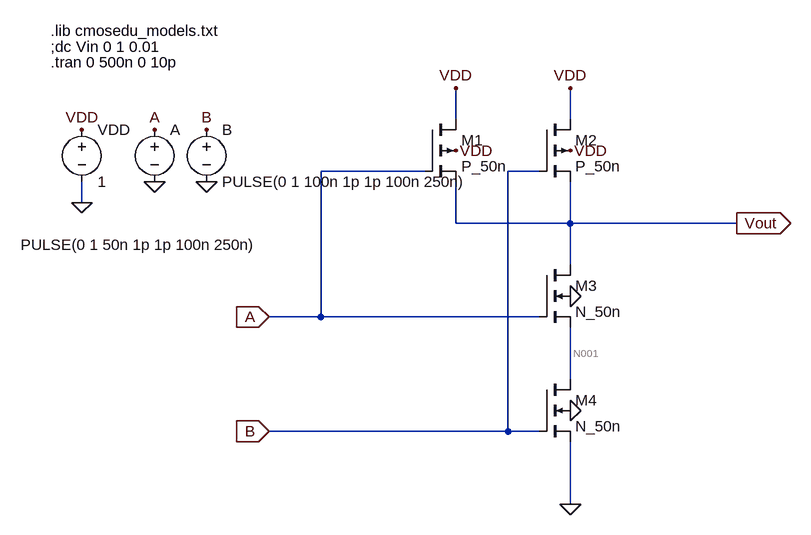
[diagram p0: schematic NAND.asc]
NAND.asc, the LTspice schematic file:
Version 4
SHEET 1 880 680
WIRE -304 -304 -304 -352
WIRE -128 -304 -128 -352
WIRE -352 -224 -512 -224
WIRE -176 -224 -224 -224
WIRE -880 -176 -880 -208
WIRE -304 -144 -304 -208
WIRE -128 -144 -128 -208
WIRE -128 -144 -304 -144
WIRE 128 -144 -128 -144
WIRE -128 -80 -128 -144
WIRE -512 0 -512 -224
WIRE -512 0 -592 0
WIRE -176 0 -512 0
WIRE -128 96 -128 16
WIRE -224 176 -224 -224
WIRE -224 176 -592 176
WIRE -176 176 -224 176
WIRE -128 288 -128 192
FLAG -880 -176 0
FLAG -880 -288 VDD
FLAG -768 -288 A
FLAG -688 -288 B
FLAG -768 -208 0
FLAG -688 -208 0
FLAG -128 288 0
FLAG -304 -352 VDD
FLAG -128 -352 VDD
FLAG -592 0 A
IOPIN -592 0 In
FLAG -592 176 B
IOPIN -592 176 In
FLAG -304 -256 VDD
FLAG -128 -256 VDD
FLAG -128 -32 0
FLAG -128 144 0
FLAG 128 -144 Vout
IOPIN 128 -144 Out
SYMBOL voltage -880 -304 R0
SYMATTR InstName VDD
SYMATTR Value 1
SYMBOL voltage -768 -304 R0
WINDOW 3 -206 193 Left 2
WINDOW 123 0 0 Left 0
WINDOW 39 0 0 Left 0
SYMATTR InstName A
SYMATTR Value PULSE(0 1 50n 1p 1p 100n 250n)
SYMBOL voltage -688 -304 R0
WINDOW 123 0 0 Left 0
WINDOW 39 0 0 Left 0
SYMATTR InstName B
SYMATTR Value PULSE(0 1 100n 1p 1p 100n 250n)
SYMBOL pmos4 -352 -304 R0
SYMATTR InstName M1
SYMATTR Value P_50n
SYMATTR Value2 l=50n w=0.4u
SYMBOL pmos4 -176 -304 R0
SYMATTR InstName M2
SYMATTR Value P_50n
SYMATTR Value2 l=50n w=0.4u
SYMBOL nmos4 -176 -80 R0
SYMATTR InstName M3
SYMATTR Value N_50n
SYMATTR Value2 l=50n w=0.4u
SYMBOL nmos4 -176 96 R0
SYMATTR InstName M4
SYMATTR Value N_50n
SYMATTR Value2 l=50n w=0.4u
TEXT -928 -416 Left 2 !;dc Vin 0 1 0.01
TEXT -928 -440 Left 2 !.lib cmosedu_models.txt
TEXT -928 -392 Left 2 !.tran 0 500n 0 10p

The netlist it stands for:
* NAND.asc
VDD VDD 0 1
V§A A 0 PULSE(0 1 50n 1p 1p 100n 250n)
V§B B 0 PULSE(0 1 100n 1p 1p 100n 250n)
M1 VDD A Vout VDD P_50n l=50n w=0.4u
M2 VDD B Vout VDD P_50n l=50n w=0.4u
M3 Vout A N001 0 N_50n l=50n w=0.4u
M4 N001 B 0 0 N_50n l=50n w=0.4u
.model NMOS NMOS
.model PMOS PMOS
.lib standard.mos
;dc Vin 0 1 0.01
.lib cmosedu_models.txt
.tran 0 500n 0 10p
.backanno
.end

* Results of the author's LTspice run, read from the files saved beside the schematic
* Operating Point, zero values left out:
*   V(vdd) = 1 V
*   V(vout) = 1 V
*   V(n001) = 38.1 mV
*   Id(M4) = 643.9 pA
*   Is(M4) = -643.8 pA
*   Id(M3) = 1.139 nA
*   Ig(M3) = -494.3 pA
*   Ib(M3) = -1.038 pA
*   Is(M3) = -643.9 pA
*   Id(M2) = 7.435 nA
*   Ig(M2) = -6.92 nA
*   Ib(M2) = 54.88 pA
*   Is(M2) = -569.6 pA
*   Id(M1) = 7.435 nA
*   Ig(M1) = -6.92 nA
*   Ib(M1) = 54.88 pA
*   Is(M1) = -569.6 pA
*   I(B) = 6.92 nA
*   I(A) = 7.415 nA
*   I(Vdd) = -14.98 nA
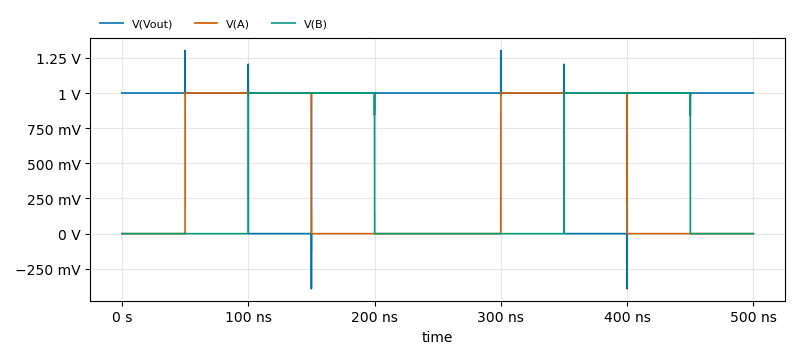
[diagram p1: Transient Analysis of NAND.asc, plotted from the saved traces]
* Transient Analysis, 1 run:
*   V(Vout): min -392.2 mV, max 1.303 V, average 800 mV, rms 894.4 mV, last 1 V
*   V(A): min 0 V, max 1 V, average 400 mV, rms 632.5 mV, last 0 V
*   V(B): min 0 V, max 1 V, average 400 mV, rms 632.5 mV, last 0 V